# EAGLE design minutka_hlavni (EAGLE 9.6.2)
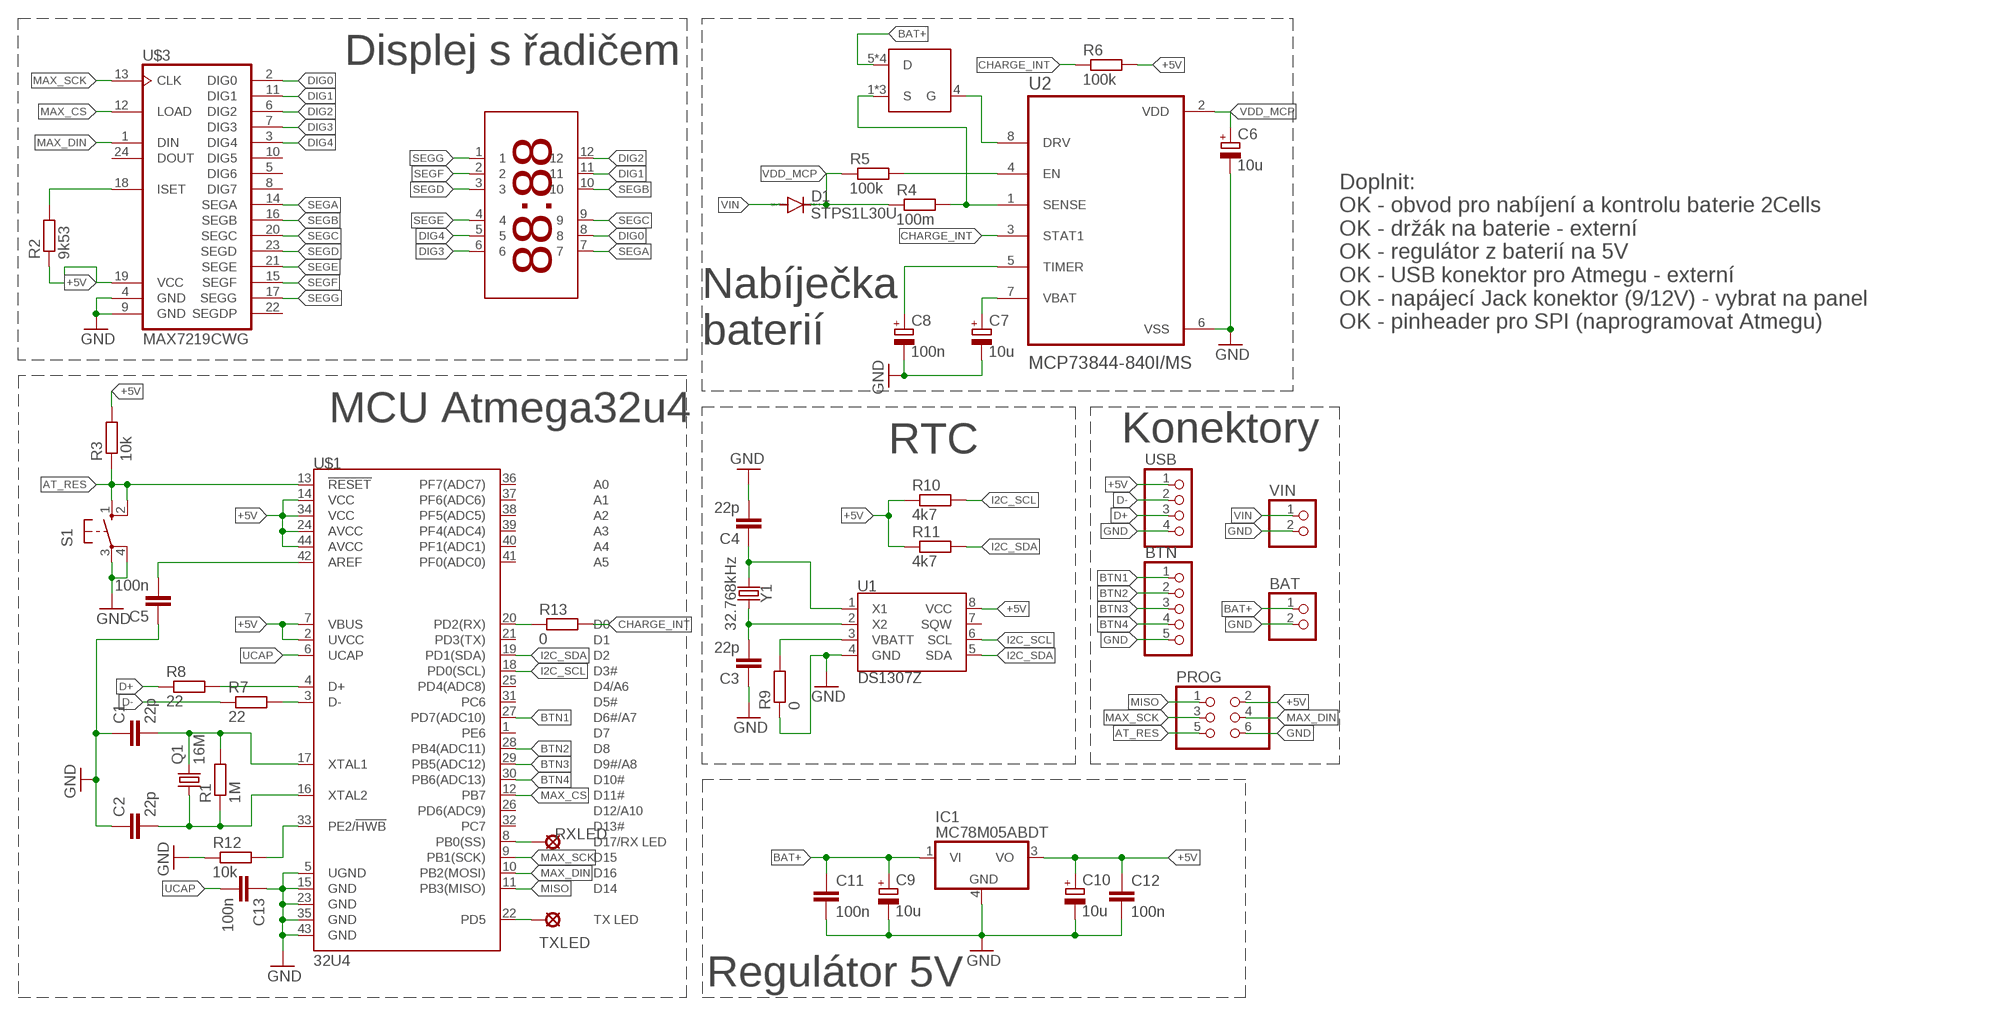
[diagram p0: schematic, sheet 1]

## Parts
BAT  PINHD-1X2  [1X02]
BTN  PINHD-1X5  [1X05]
C1  22p  C-EUC0603  [C0603]
C2  22p  C-EUC0603  [C0603]
C3  22p  C-EUC0603  [C0603]
C4  22p  C-EUC0603  [C0603]
C5  100n  C-EUC0603  [C0603]
C6  10u  CPOL-EU085CS-1AR  [085CS_1AR]
C7  10u  CPOL-EU085CS-1AR  [085CS_1AR]
C8  100n  CPOL-EU085CS-1AR  [085CS_1AR]
C9  10u  CPOL-EU085CS-1AR  [085CS_1AR]
C10  10u  CPOL-EU085CS-1AR  [085CS_1AR]
C11  100n  C-EUC0603  [C0603]
C12  100n  C-EUC0603  [C0603]
C13  100n  C-EUC0603  [C0603]
D1  STPS1L30U  DIODE-DO214AA  [DO214AA]
IC1  MC78M05ABDT  [DPACK_3]
PROG  PINHD-2X3  [2X03]
Q1  16M  CRYSTALHC49UP  [HC49UP]
R1  1M  R-EU_R0603  [R0603]
R2  9k53  R-EU_R0603  [R0603]
R3  10k  R-EU_R0603  [R0603]
R4  100m  R-EU_R0603  [R0603]
R5  100k  R-EU_R0603  [R0603]
R6  100k  R-EU_R0603  [R0603]
R7  22  R-EU_R0603  [R0603]
R8  22  R-EU_R0603  [R0603]
R9  0  R-EU_R0603  [R0603]
R10  4k7  R-EU_R0603  [R0603]
R11  4k7  R-EU_R0603  [R0603]
R12  10k  R-EU_R0603  [R0603]
R13  0  R-EU_R0603  [R0603]
RXLED  LSP13  [LSP13]
S1  10-XX  [B3F-10XX]
TXLED  LSP13  [LSP13]
U1  DS1307Z  [SO08-0.15]
U2  MCP73844-840I/MS  [SOP65P490X110-8N]
U$1  32U4  ATMEGA32U4TQFP-44  [TQFP44]
U$2  KW4-8828AVB  [KW4-8828AVB]
U$3  MAX7219CWG  [SO24L]
U$4  NDS8434  [SO08]
USB  PINHD-1X4  [1X04]
VIN  PINHD-1X2  [1X02]
Y1  32.768kHz  CRYSTAL-32.768KHZSMD-2X6  [CRYSTAL-SMD-2X6-CYL]

## Nets
+5V: C10.+ C12.1 IC1.3(VO) PROG.2 R2.1 R3.2 R6.2 R10.1 R11.1 U1.8(VCC) U$1.2(UVCC) U$1.7(VBUS) U$1.14(VCC) U$1.24(AVCC) U$1.34(VCC) U$1.44(AVCC) U$3.19(VCC) USB.1
AT_RES: PROG.5 R3.1 S1.1(S) S1.2(S1) U$1.13(!RESET)
BAT+: BAT.1 C9.+ C11.1 IC1.1(VI) U$4.5(D) U$4.6(D) U$4.7(D) U$4.8(D)
BTN1: BTN.1 U$1.27(PD7(ADC10))
BTN2: BTN.2 U$1.28(PB4(ADC11))
BTN3: BTN.3 U$1.29(PB5(ADC12))
BTN4: BTN.4 U$1.30(PB6(ADC13))
CHARGE_INT: R6.1 R13.2 U2.3(STAT1)
D+: R8.1 USB.3
D-: R7.1 USB.2
DIG0: U$2.8 U$3.2(DIG0)
DIG1: U$2.11 U$3.11(DIG1)
DIG2: U$2.12 U$3.6(DIG2)
DIG3: U$2.6 U$3.7(DIG3)
DIG4: U$2.5 U$3.3(DIG4)
GND: BAT.2 BTN.5 C1.1 C2.1 C3.1 C4.2 C5.1 C6.- C7.- C8.- C9.- C10.- C11.2 C12.2 C13.1 IC1.4(GND) PROG.6 R9.1 R12.1 S1.3(P) S1.4(P1) U1.4(GND) U2.6(VSS) U$1.5(UGND) U$1.15(GND) U$1.23(GND) U$1.35(GND) U$1.43(GND) U$3.4(GND) U$3.9(GND) USB.4 VIN.2
I2C_SCL: R10.2 U1.6(SCL) U$1.18(PD0(SCL))
I2C_SDA: R11.2 U1.5(SDA) U$1.19(PD1(SDA))
MAX_CS: U$1.12(PB7) U$3.12(LOAD)
MAX_DIN: PROG.4 U$1.10(PB2(MOSI)) U$3.1(DIN)
MAX_SCK: PROG.3 U$1.9(PB1(SCK)) U$3.13(CLK)
MISO: PROG.1 U$1.11(PB3(MISO))
N$1: C1.2 Q1.2 R1.2 U$1.17(XTAL1)
N$2: C2.2 Q1.1 R1.1 U$1.16(XTAL2)
N$3: C4.1 U1.1(X1) Y1.X1
N$4: C3.2 U1.2(X2) Y1.X2
N$5: U2.8(DRV) U$4.4(G)
N$6: R4.2 U2.1(SENSE) U$4.1(S) U$4.2(S) U$4.3(S)
N$7: R2.2 U$3.18(ISET)
N$8: C5.2 U$1.42(AREF)
N$9: C7.+ U2.7(VBAT)
N$10: R8.2 U$1.4(D+)
N$11: R7.2 U$1.3(D-)
N$12: C8.+ U2.5(TIMER)
N$13: R12.2 U$1.33(PE2/!HWB)
N$14: TXLED.MP U$1.22(PD5)
N$15: R5.2 U2.4(EN)
N$16: RXLED.MP U$1.8(PB0(SS))
N$17: R13.1 U$1.20(PD2(RX))
RTC_VBAT+: R9.2 U1.3(VBATT)
SEGA: U$2.7 U$3.14(SEGA)
SEGB: U$2.10 U$3.16(SEGB)
SEGC: U$2.9 U$3.20(SEGC)
SEGD: U$2.3 U$3.23(SEGD)
SEGE: U$2.4 U$3.21(SEGE)
SEGF: U$2.2 U$3.15(SEGF)
SEGG: U$2.1 U$3.17(SEGG)
UCAP: C13.2 U$1.6(UCAP)
VDD_MCP: C6.+ D1.C R4.1 R5.1 U2.2(VDD)
VIN: D1.A VIN.1
Unconnected: U1.7(SQW) U$1.1(PE6) U$1.21(PD3(TX)) U$1.25(PD4(ADC8)) U$1.26(PD6(ADC9)) U$1.31(PC6) U$1.32(PC7) U$1.36(PF7(ADC7)) U$1.37(PF6(ADC6)) U$1.38(PF5(ADC5)) U$1.39(PF4(ADC4)) U$1.40(PF1(ADC1)) U$1.41(PF0(ADC0)) U$3.5(DIG6) U$3.8(DIG7) U$3.10(DIG5) U$3.22(SEGDP) U$3.24(DOUT)

## Notes on the sheet
- Displej s řadičem
- Doplnit:
  OK - obvod pro nabíjení a kontrolu baterie 2Cells
  OK - držák na baterie - externí
  OK - regulátor z baterií na 5V
  OK - USB konektor pro Atmegu - externí
  OK - napájecí Jack konektor (9/12V) - vybrat na panel
  OK - pinheader pro SPI (naprogramovat Atmegu)
- Nabíječka
  baterií
- MCU Atmega32u4
- RTC | Konektory
- Regulátor 5V

## Library data of the parts
BAT VIN = pinhead:PINHD-1X2: PIN HEADER
BTN = pinhead:PINHD-1X5: PIN HEADER
C1-C5 C11-C13 = rcl:C-EU: CAPACITOR, European symbol; SPICEPREFIX: C
C6-C10 = rcl:CPOL-EU: POLARIZED CAPACITOR, European symbol; SPICEPREFIX: C
D1 = diode:DIODE-: DIODE
IC1 = linear:MC78M: 500 mA Positive Voltage Regulators Source: Data sheet <http://www.onsemi.com/pub_link/Collateral/MC78M00-D.PDF>
PROG = pinhead:PINHD-2X3: PIN HEADER
Q1 = crystal:CRYSTAL: CRYSTAL; OC_FARNELL: unknown; OC_NEWARK: unknown
R1-R13 = rcl:R-EU_: RESISTOR, European symbol; SPICEPREFIX: R
RXLED TXLED = solpad:LSP13: SOLDER PAD drill 1.3 mm, distributor Buerklin, 12H562
S1 = switch-omron:10-XX: OMRON SWITCH; MPN: B3F-1000; OC_FARNELL: 176432; OC_NEWARK: 36M3542
U1 = SparkFun-Clocks:DS1307: Maxim DS1307 - I2C Real-time clock (RTC) The DS1307 serial real-time clock (RTC) is a low-power, full binary-coded decimal (BCD) clock/calendar plus 56 bytes of NV SRAM. Address and data are transferred serially through an I2C, bidirectional bus. The clock/calendar provides seconds, minutes, hours, day, date, month, and year information. SparkFun Products: Real Time Clock Module <https://www.sparkfun.com/products/12708> (BOB-12708) Datasheet <https://cdn.sparkfun.com/datasheets/BreakoutBoards/DS1307.pdf>; PROD_ID: IC-08138
U2 = bastlir:MCP73844-840I/MS: None; AVAILABILITY: Unavailable; DESCRIPTION: Charger IC Lithium Ion/Polymer 8-MSOP; DIGIKEY-PURCHASE-URL: https://snapeda.com/shop?store=DigiKey&id=235235; MF: Microchip; MOUSER-PURCHASE-URL: https://snapeda.com/shop?store=Mouser&id=235235; MP: MCP73844-840I/MS; PACKAGE: MSOP-8 Microchip; PRICE: None
U$1 = SparkFun-IC-Microcontroller:ATMEGA32U4: Atmel MCU, 32KByte Atmel 44-pin 8-bit Microcontroller with 32KBytes of ISP Flash and USB Controller Datasheet <http://cdn.sparkfun.com/datasheets/Dev/Arduino/Boards/ATMega32U4.pdf> SparkFun Products LilyPad Arduino USB - ATmega32U4 Board <https://www.sparkfun.com/products/12049> (DEV-12049) Pro Micro - 5V/16MHz <https://www.sparkfun.com/products/12640> (DEV-12640) Pro Micro - 3.3V/8MHz <https://www.sparkfun.com/products/12587> (DEV-12587) Fio v3 - ATmega32U4 <https://www.sparkfun.com/products/11520> (DEV-11520) Qduino Mini <https://www.sparkfun.com/products/13614> (DEV-13614) Makey Makey - Standard Kit <https://www.sparkfun.com/products/11511> (WIG-11511) Makey Makey Deluxe Kit <https://www.sparkfun.com/products/11519> (WIG-11519); PROD_ID: IC-11161
U$2 = bastlir:KW4-8828AVB: Displej sedmisegmentový 4 číslice 0,94" https://www.tme.eu/cz/details/kw4-8828avb/ctyrmistne-led-displeje/lucky-light/
U$3 = bastlir:MAX7219CWG
U$4 = bastlir:NDS8434; ARROW_ELECTRONICS-PURCHASE-URL: https://snapeda.com/shop?store=Arrow+Electronics&id=4825898; AVAILABILITY: Unavailable; DESCRIPTION: MOSFET Single P-Ch FET Enhancement Mode; MF: ON Semiconductor / Fairchild; MOUSER-PURCHASE-URL: https://snapeda.com/shop?store=Mouser&id=4825898; MP: NDS8434; PACKAGE: None; PRICE: None
USB = pinhead:PINHD-1X4: PIN HEADER
Y1 = SparkFun-Clocks:CRYSTAL-32.768KHZ: 32.768kHz Crystal Frequency: 32.768kHz Frequency Stability: ±20ppm Load Capacitance: 12.5pF (PTH-2X6 & SMD-3.2X1.5), 6pF (SMD-2X6) SparkFun Products: SparkFun BigTime Watch Kit <https://www.sparkfun.com/products/11734> SparkFun nRF52832 Breakout <https://www.sparkfun.com/products/13990> SparkFun Real Time Clock Module <https://www.sparkfun.com/products/12708>; PROD_ID: XTAL-07894

## Board
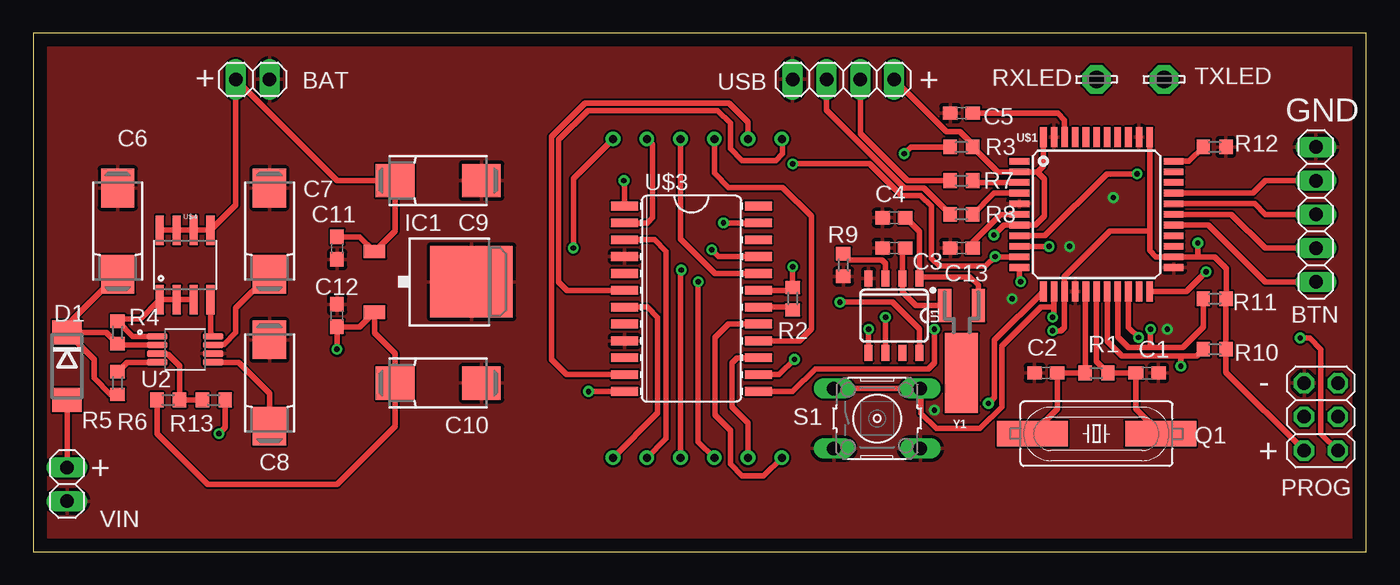
[diagram p1: board, top side]
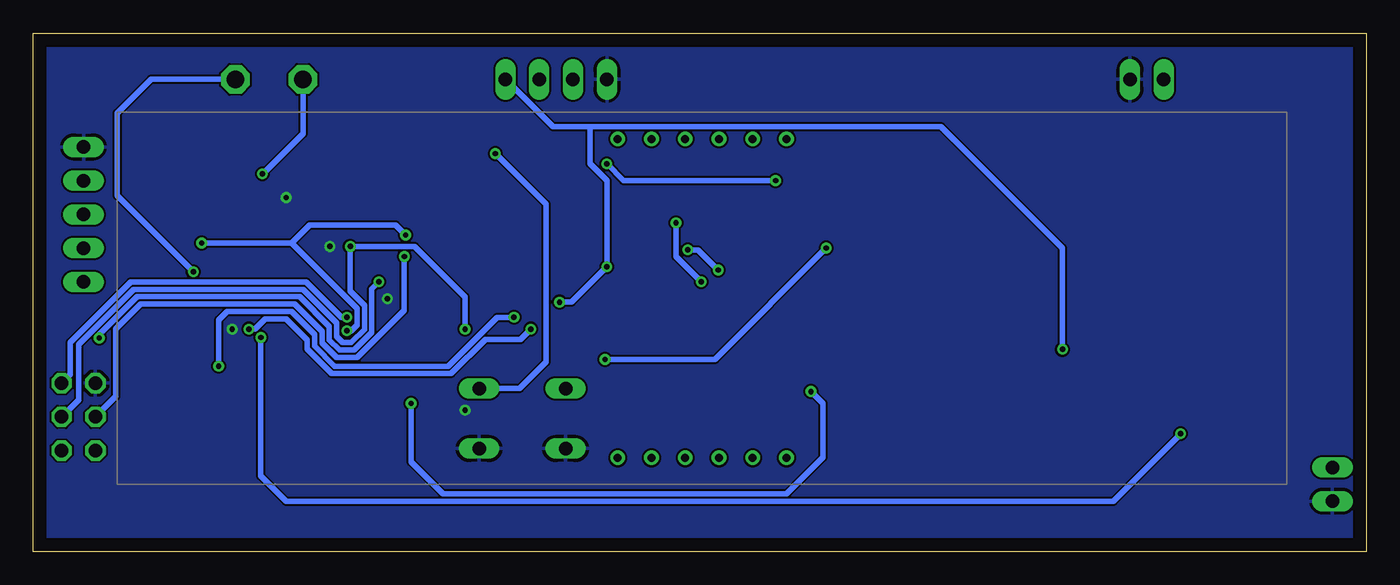
[diagram p2: board, bottom side, seen from below]

Size 100.31 x 39.04 mm. Coordinates in mm from the lower left corner, seen from the top.
Outline: 0,0 100.31,0 100.31,39.04 0,39.04 0,0
Copper layers (1*16): Top 0.035mm / dielectric 1mm / Bottom 0.035mm
Design rules "default *": minimum track width 6mil, minimum drill 0.35mm, track to track 6mil, track to pad 6mil, pad to pad 6mil, via to via 6mil, smd to smd 6mil, copper to edge 40mil, drill to drill 6mil, minimum pad ring 10mil, minimum via ring 8mil, stop-mask expansion 4mil, vias tented up to drill 0mil, thermal gap 10mil

### Footprints (pad centres in the part's own frame; a part is rotated, then mirrored left to right if it is on the bottom)
1X02 = drill 1.016 long: 1 -1.27,0; 2 1.27,0
1X05 = drill 1.016 long: 1 -5.08,0; 2 -2.54,0; 3 0,0; 4 2.54,0; 5 5.08,0
C0603 = smd 1.1 x 1: 1 -0.85,0; 2 0.85,0
085CS_1AR = smd 2.9 x 2.5: + 3.25,0; - -3.25,0
DO214AA = smd 1.8 x 2.2: A 2.55,0; C -2.55,0
DPACK_3 = smd 1 x 1.6: 1 -2.28,-4.8; 3 2.28,-4.8 | smd 5.4 x 6.2: 4 0,2.5
2X03 = drill 1.016 octagon: 1 -2.54,-1.27; 2 -2.54,1.27; 3 0,-1.27; 4 0,1.27; 5 2.54,-1.27; 6 2.54,1.27
HC49UP = smd 5.334 x 1.93: 1 -4.826,0; 2 4.826,0
R0603 = smd 1 x 1.1: 1 -0.85,0; 2 0.85,0
LSP13 = drill 1.321 pad 2.159 octagon: MP 0,0
B3F-10XX = drill 1.016 long: 1 -3.251,2.261; 2 3.251,2.261; 3 -3.251,-2.261; 4 3.251,-2.261
SO08-0.15 = smd 0.6 x 1.2: 1 -1.905,-2.8; 2 -0.635,-2.8; 3 0.635,-2.8; 4 1.905,-2.8; 5 1.905,2.8; 6 0.635,2.8; 7 -0.635,2.8; 8 -1.905,2.8
SOP65P490X110-8N = smd 1.5 x 0.49: 1 -2.105,0.975; 2 -2.105,0.325; 3 -2.105,-0.325; 4 -2.105,-0.975; 5 2.105,-0.975; 6 2.105,-0.325; 7 2.105,0.325; 8 2.105,0.975
TQFP44 = smd 1.5 x 0.5: 1 -5.8,4; 2 -5.8,3.2; 3 -5.8,2.4; 4 -5.8,1.6; 5 -5.8,0.8; 6 -5.8,0; 7 -5.8,-0.8; 8 -5.8,-1.6; 9 -5.8,-2.4; 10 -5.8,-3.2; 11 -5.8,-4; 23 5.8,-4; 24 5.8,-3.2; 25 5.8,-2.4; 26 5.8,-1.6; 27 5.8,-0.8; 28 5.8,0; 29 5.8,0.8; 30 5.8,1.6; 31 5.8,2.4; 32 5.8,3.2; 33 5.8,4 | smd 0.5 x 1.5: 12 -4,-5.8; 13 -3.2,-5.8; 14 -2.4,-5.8; 15 -1.6,-5.8; 16 -0.8,-5.8; 17 0,-5.8; 18 0.8,-5.8; 19 1.6,-5.8; 20 2.4,-5.8; 21 3.2,-5.8; 22 4,-5.8; 34 4,5.8; 35 3.2,5.8; 36 2.4,5.8; 37 1.6,5.8; 38 0.8,5.8; 39 0,5.8; 40 -0.8,5.8; 41 -1.6,5.8; 42 -2.4,5.8; 43 -3.2,5.8; 44 -4,5.8
KW4-8828AVB = drill 0.6: 1 -6.8,-11.97; 2 -4.26,-11.97; 3 -1.72,-11.97; 4 0.82,-11.97; 5 3.36,-11.97; 6 5.9,-11.97; 7 5.9,12.03; 8 3.36,12.03; 9 0.82,12.03; 10 -1.72,12.03; 11 -4.26,12.03; 12 -6.8,12.03
SO24L = smd 0.66 x 2.032: 1 -6.985,-5.029; 2 -5.715,-5.029; 3 -4.445,-5.029; 4 -3.175,-5.029; 5 -1.905,-5.029; 6 -0.635,-5.029; 7 0.635,-5.029; 8 1.905,-5.029; 9 3.175,-5.029; 10 4.445,-5.029; 11 5.715,-5.029; 12 6.985,-5.029; 13 6.985,5.029; 14 5.715,5.029; 15 4.445,5.029; 16 3.175,5.029; 17 1.905,5.029; 18 0.635,5.029; 19 -0.635,5.029; 20 -1.905,5.029; 21 -3.175,5.029; 22 -4.445,5.029; 23 -5.715,5.029; 24 -6.985,5.029
SO08 = smd 0.61 x 2.21: 1 -1.905,-2.616; 2 -0.635,-2.616; 3 0.635,-2.616; 4 1.905,-2.616; 5 1.905,2.616; 6 0.635,2.616; 7 -0.635,2.616; 8 -1.905,2.616
1X04 = drill 1.016 long: 1 -3.81,0; 2 -1.27,0; 3 1.27,0; 4 3.81,0
CRYSTAL-SMD-2X6-CYL = smd 2.5 x 6: SHEILD 0,5.08 | smd 1 x 2.5: X1 -1.27,0; X2 1.27,0

### Placement (x,y rotation side)
BAT  16.51,35.56 0 top
BTN  96.52,25.4 90 top
C1  83.82,13.46 180 top
C2  76.2,13.46 0 top
C3  64.77,22.86 0 top
C4  64.77,25.15 180 top
C5  69.85,33.02 0 top
C6  6.35,24.13 270 top
C7  17.78,24.13 270 top
C8  17.78,12.7 270 top
C9  30.48,27.94 180 top
C10  30.48,12.7 180 top
C11  22.86,22.86 270 top
C12  22.86,17.78 90 top
C13  69.85,22.86 0 top
D1  2.54,13.97 270 top
IC1  30.48,20.32 270 top
PROG  96.9,10.16 90 top
Q1  80.01,8.89 0 top
R1  80.01,13.46 0 top
R2  57.15,19.05 270 top
R3  69.85,30.48 0 top
R4  6.35,16.51 90 top
R5  6.35,12.7 90 top
R6  10.16,11.43 180 top
R7  69.85,27.94 0 top
R8  69.85,25.4 0 top
R9  60.96,21.59 90 top
R10  88.9,15.24 180 top
R11  88.9,19.05 180 top
R12  88.9,30.48 180 top
R13  13.59,11.43 180 top
RXLED  80.01,35.56 0 top
S1  63.5,10.03 0 top
TXLED  85.09,35.56 0 top
U1  64.77,17.78 180 top
U2  11.43,15.24 0 top
U$1  80.01,25.4 0 top
U$2  49.53,19.05 0 bottom
U$3  49.53,19.05 270 top
U$4  11.43,21.59 0 top
USB  60.96,35.56 180 top
VIN  2.54,5.08 270 top
Y1  69.85,18.54 180 top

### Tracks (layer width: path | path; a pad name or v marks a point on that pad's centre or on a via)
+5V  (via drill 0.4)
  Top 0.406: R6.2 9.31,8.89 13.12,5.08 22.86,5.08 27.23,9.45 C10.+ 27.23,14.93 25.68,16.48 IC1.3 24.57,16.93 C12.1 v22.86,15.24 | U$3.19 56.94,19.68 R2.1 v57.15,21.46 | U1.8 66.67,16.76 64.64,18.8 v60.71,18.8 | 87.63,22.2 U$1.24 84.48,22.2 84.01,22.67 84.01,24.13 | 87.63,22.2 88.92,22.2 89.79,21.34 89.79,19.09 R11.1 R10.1 89.75,13.5 PROG.2 | v76.71,16.64 77.34,16.64 77.61,16.9 U$1.14 77.61,20.71 81.03,24.13 84.01,24.13 | v87.63,23.24 87.63,22.2 | U$1.34 84.01,24.13 | U$1.44 76.01,29.02 75.56,28.57 | 75.56,28.57 74.23,28.57 U$1.2 72.58,28.6 R3.2 70.7,30.65 69.72,31.62 68.71,31.62 USB.1 | 75.56,28.57 76.07,28.07 76.07,25.27 75.4,24.6 U$1.7 73.04,24.6 v72.29,23.85
  Bottom 0.406: v60.71,18.8 59.82,18.8 v57.15,21.46 57.15,27.94 58.42,29.21 58.42,31.99 | 80.87,23.24 75.95,18.32 75.95,17.09 76.4,16.64 v76.71,16.64 | 80.87,23.24 v87.63,23.24 | 58.42,31.99 31.99,31.99 22.86,22.86 v22.86,15.24 | USB.1 61.2,31.99 58.42,31.99 | v72.29,23.85 73.05,24.61 79.5,24.61 80.87,23.24
AT_RES  (via drill 0.4)
  Top 0.406: U$1.13 76.81,18.41 | 76.81,18.41 76.81,17.75 v76.71,17.65 | R3.1 66.04,30.48 v65.53,29.97 | S1.1 S1.2 66.8,12.24 66.8,10.41 67.94,9.27 71.25,9.27 72.9,10.92 72.9,15.49 75.82,18.41 76.81,18.41
  Bottom 0.406: v76.71,17.65 77.09,17.65 79.76,20.32 92.99,20.32 97.54,15.78 97.54,13.34 PROG.5 | v65.53,29.97 61.72,26.16 61.72,14.28 63.7,12.29 S1.2
BAT+
  Top 0.406: C11.1 24.57,23.71 IC1.1 27.23,24.15 C9.+ 22.86,27.94 BAT.1 15.24,26.11 U$4.5 U$4.6 U$4.7 U$4.8
BTN1
  Top 0.406: U$1.27 88.43,24.6 92.71,20.32 BTN.1
BTN2
  Top 0.406: U$1.28 90.17,25.4 92.71,22.86 BTN.2
BTN3
  Top 0.406: U$1.29 91.91,26.2 92.71,25.4 BTN.3
BTN4
  Top 0.406: U$1.30 91.77,27 92.71,27.94 BTN.4
CHARGE_INT
  Top 0.406: U2.3 9.37,14.87 10.15,14.87 11.01,14.01 R6.1 R13.2
D+
  Top 0.406: R8.1 67.02,27.38 65.56,27.38 59.69,33.25 USB.3
D-
  Top 0.406: R7.1 65.79,27.94 62.23,31.5 USB.2
DIG0
  Top 0.406: U$3.2 46.23,24.77 46.61,25.15 46.61,30.64 U$2.8
DIG1
  Top 0.406: U$2.11 53.79,32.35 52.36,33.78 41.53,33.78 38.99,31.24 38.99,14.48 40.13,13.34 U$3.11
DIG2
  Top 0.406: U$3.6 40.18,19.68 39.55,20.32 39.55,31.01 41.76,33.22 51.49,33.22 52.45,32.26 52.45,30.35 53.34,29.46 55.88,29.46 56.39,29.97 56.39,31.02 U$2.12
DIG3
  Top 0.406: U$3.7 46.23,18.41 46.99,17.65 46.99,10.44 U$2.6
DIG4
  Top 0.406: U$3.3 46.74,23.5 47.62,22.61 47.62,8.54 U$2.5
GND  (via drill 0.4)
  other vias: 81.28,26.67 67.82,10.67 85.34,16.76 77.98,22.99 73.66,19.05
  pour Top: 0,0 101.6,0 101.6,40.64 0,40.64
  pour Bottom: 0,0 102.87,0 102.87,41.91 0,41.91
I2C_SCL  (via drill 0.4)
  Top 0.406: U$1.18 80.81,15.84 81.92,14.73 86.36,14.73 | R10.2 87.54,14.73 86.36,14.73 | 86.36,14.73 v86.36,13.97 | v64.14,17.65 U1.6
  Bottom 0.406: v86.36,13.97 86.36,17.45 85.72,18.09 80.88,18.09 79.14,16.35 79.14,15.5 77.61,13.97 69.09,13.97 65.41,17.65 v64.14,17.65
I2C_SDA  (via drill 0.4)
  Top 0.406: U$1.19 81.61,16.18 82.42,15.37 84.07,15.37 | 84.07,15.37 86.49,15.37 88.05,16.93 R11.2 | v84.07,16.76 84.07,15.37 | v62.87,16.76 U1.5
  Bottom 0.406: v84.07,16.76 83.62,16.76 82.86,17.53 81.28,17.53 79.7,15.95 79.7,15.27 77.84,13.41 68.86,13.41 66.27,16 63.63,16 v62.87,16.76
MAX_CS  (via drill 0.4)
  Top 0.406: v41.78,12.06 U$3.12 | U$1.12 72.34,15.93 72.34,11.63 v71.88,11.18
  Bottom 0.406: v41.78,12.06 40.89,11.18 40.89,7.11 43.64,4.37 69.47,4.37 71.88,6.78 v71.88,11.18
MAX_DIN  (via drill 0.4)
  Top 0.406: U$1.10 72.42,22.2 v72.39,22.23 71.66,21.5 68.18,21.5 67.59,22.09 67.59,26.01 66.78,26.82 65.32,26.82 62.94,29.21 v57.15,29.21 | U$3.1 44.5,27.89 v44.45,27.94
  Bottom 0.406: PROG.4 94.11,11.68 94.11,16.76 92.23,18.64 80.64,18.64 78.58,16.58 78.58,15.73 77.48,14.63 75.93,14.63 72.39,18.17 v72.39,22.22 v72.39,22.23 | v57.15,29.21 55.88,27.94 v44.45,27.94
MAX_SCK  (via drill 0.4)
  Top 0.406: v76.45,22.99 74.22,22.99 U$1.9 | U$3.13 57.15,12.06 58.86,13.78 67.37,13.78 67.82,14.22 v67.82,16.76
  Bottom 0.406: PROG.3 96.9,11.43 96.9,15.62 92.76,19.76 80.01,19.76 77.47,17.22 77.47,16.2 77.02,15.75 76.39,15.75 75.39,16.75 75.39,18.55 76.45,19.61 v76.45,22.99 71.63,22.99 67.82,19.18 v67.82,16.76
MISO  (via drill 0.4)
  Top 0.406: PROG.1 96.9,8.89 96.9,15.24 96.04,16.1 v95.35,16.1 | v74.3,20.32 74.21,20.41 U$1.11
  Bottom 0.406: v95.35,16.1 95.35,16.35 92.5,19.2 80.26,19.2 78.03,16.96 78.03,15.96 77.25,15.19 76.16,15.19 74.83,16.52 74.83,19.78 v74.3,20.32
N$1
  Top 0.406: Q1.2 82.97,10.76 C1.2 R1.2 80.01,14.31 U$1.17
N$2
  Top 0.406: Q1.1 77.05,10.76 C2.2 R1.1 79.16,19.55 U$1.16
N$3
  Top 0.406: C4.1 66.67,24.09 U1.1 66.8,20.7 70.48,20.7 71.12,20.07 Y1.X1
N$4
  Top 0.406: C3.2 65.41,22.64 U1.2 65.41,19.56 66.42,18.54 Y1.X2
N$5
  Top 0.406: U2.8 13.34,16.41 U$4.4
N$6
  Top 0.406: U2.1 7.5,16.21 R4.2 6.52,17.53 8.08,17.53 U$4.1 U$4.2 U$4.3
N$7
  Top 0.406: U$3.18 56.94,18.41 R2.2
N$8
  Top 0.406: U$1.42 77.61,32.5 77.09,33.02 C5.2
N$9
  Top 0.406: U2.7 13.58,15.61 14.36,15.61 15.24,16.49 15.24,18.34 C7.+
N$10
  Top 0.406: U$1.4 72.3,27 R8.2
N$11
  Top 0.406: U$1.3 70.84,27.8 R7.2
N$12
  Top 0.406: U2.5 15.45,14.27 17.78,11.94 C8.+
N$13
  Top 0.406: U$1.33 86.97,29.4 R12.2
N$14  (via drill 0.4)
  Top 0.406: v88.27,21.08 86.78,19.6 U$1.22
  Bottom 0.406: TXLED.MP 91.44,35.56 93.98,33.02 93.98,26.8 v88.27,21.08
N$15
  Top 0.406: U2.4 7.07,14.27 R5.2
N$16  (via drill 0.4)
  Top 0.406: U$1.8 76.12,23.8 80.77,28.45 v83.06,28.45
  Bottom 0.406: v83.06,28.45 80.01,31.5 RXLED.MP
N$17  (via drill 0.4)
  Top 0.406: U$1.20 82.41,16.9 v83.19,16.13 | R13.1 14.44,9.36 v13.97,8.89
  Bottom 0.406: v83.19,16.13 83.19,5.71 81.28,3.81 19.05,3.81 v13.97,8.89
RTC_VBAT+
  Top 0.406: U1.3 64.14,21.72 63.88,21.97 61.43,21.97 R9.2
SEGA  (via drill 0.4)
  Top 0.406: U$3.14 56.13,13.34 v57.28,14.48 | v40.64,22.86 40.64,28.09 U$2.7
  Bottom 0.406: v57.28,14.48 49.02,14.48 v40.64,22.86
SEGB
  Top 0.406: U$3.16 57.66,15.88 58.55,16.76 58.55,25.27 56.39,27.43 52.32,27.43 51.25,28.51 U$2.10
SEGC
  Top 0.406: U$2.9 48.71,23.55 51.31,20.95 U$3.20
SEGD  (via drill 0.4)
  Top 0.406: U$2.3 50.04,8.29 v50.04,20.32 | v51.94,24.77 U$3.23
  Bottom 0.406: v50.04,20.32 51.94,22.23 v51.94,24.77
SEGE  (via drill 0.4)
  Top 0.406: U$2.4 48.71,21.15 v48.77,21.21 | v51.05,22.73 51.56,22.23 U$3.21
  Bottom 0.406: v48.77,21.21 50.29,22.73 v51.05,22.73
SEGF
  Top 0.406: U$2.2 53.79,9.71 52.58,10.92 52.58,14.22 52.96,14.61 U$3.15
SEGG
  Top 0.406: U$2.1 54.97,5.71 53.34,5.71 52.45,6.6 52.45,9.14 51.31,10.29 51.31,16.13 52.32,17.14 U$3.17
UCAP
  Top 0.406: U$1.6 72.77,25.4 70.7,23.33 C13.2
VDD_MCP
  Top 0.406: D1.C 4.57,14.49 4.57,13.08 5.8,11.85 R5.1 | D1.C 5.49,16.52 R4.1 6.45,15.56 U2.2 | C6.+ 2.54,17.07 D1.C
VIN
  Top 0.406: VIN.1 D1.A

### Text on the board
tNames: + | + | GND | - | + | +